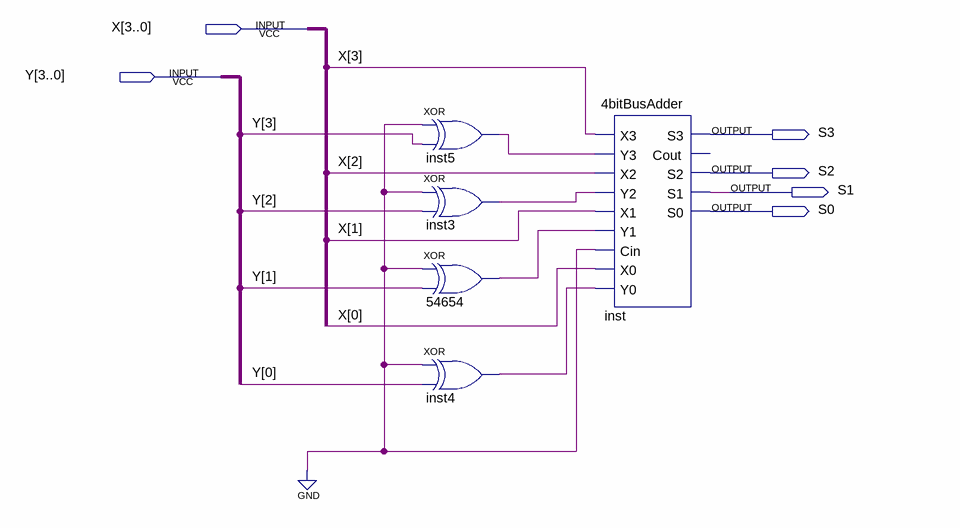
[diagram p0: schematic sheet]
// Quartus schematic BusAdder.bdf as structural Verilog: 5 symbols, 6 pins
module BusAdder (
  input  [3:0] X,
  input  [3:0] Y,
  output S3,
  output S2,
  output S1,
  output S0
);

  wire inst3_out, inst4_out, inst5_out, n54654_out;

  xor inst5 (inst5_out, 1'b0, Y[3]);
  xor inst3 (inst3_out, 1'b0, Y[2]);
  xor u_54654 (n54654_out, 1'b0, Y[1]);
  xor inst4 (inst4_out, 1'b0, Y[0]);
  \4bitBusAdder  inst (
    .X3(X[3]), .Y3(inst5_out), .X2(X[2]), .Y2(inst3_out), .X1(X[1]), .Y1(n54654_out), .Cin(1'b0), .X0(X[0]),
    .Y0(inst4_out), .S3(S3), .S2(S2), .S1(S1), .S0(S0));  // open: Cout
endmodule
